# Altium project differential driver.PrjPcb
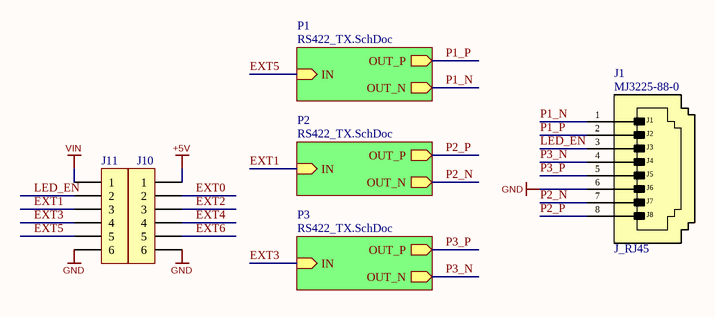
[diagram p0: differential driver.SchDoc]
2 sheets, 18 parts. Net scope: hierarchical (ports join the sheet entries above them; power ports are global).
Board file: differential driver.PcbDoc
Sheets:
  differential driver.SchDoc
    P1 = RS422_TX.SchDoc
    P2 = RS422_TX.SchDoc
    P3 = RS422_TX.SchDoc

## Sheet differential driver.SchDoc
size A; SheetNumber: 1; SheetTotal: 2

### Parts
J1  value MJ3225-88-0  [J_RJ45_MJ3225-88-0]  (hidden comment: Modular Connector, Modular Jack, 1 x 1 (Port), 8P8C, Cat3)
J10  Goldpin  [P_HEADER_1x6_2.54]  (value not drawn)
J11  Goldpin  [P_HEADER_1x6_2.54]  (value not drawn)

### Sub-sheets
P1 = RS422_TX.SchDoc: IN (in), OUT_P (out), OUT_N (out)
P2 = RS422_TX.SchDoc: IN (in), OUT_P (out), OUT_N (out)
P3 = RS422_TX.SchDoc: IN (in), OUT_P (out), OUT_N (out)

### Nets
+5V: J10.1
GND: J1.6 J10.6 J11.6
VIN: J11.1
EXT0: J10.2
EXT1: J11.3 ; sheet P2/IN
EXT2: J10.3
EXT3: J11.4 ; sheet P3/IN
EXT4: J10.4
EXT5: J11.5 ; sheet P1/IN
EXT6: J10.5
LED_EN: J1.3 J11.2
P1_N: J1.1 ; sheet P1/OUT_N
P1_P: J1.2 ; sheet P1/OUT_P
P2_N: J1.7 ; sheet P2/OUT_N
P2_P: J1.8 ; sheet P2/OUT_P
P3_N: J1.4 ; sheet P3/OUT_N
P3_P: J1.5 ; sheet P3/OUT_P

### Notes on the sheet
- (in symbol J_RJ45_MJ3225-88-0) J2; J3; J4; J5; J6; J7; J8

### Library data of the parts
J1 = J_RJ45_MJ3225-88-0: Manufacturer: Global Connector Technology; SCH_Footprint: J_RJ45; Part Number: J_RJ45_MJ3225-88-0; HelpURL: https://www.farnell.com/cad/3781788.pdf; Manufacturer Part Number: MJ3225-88-0; Supplier 1: TME; Supplier 2: RS Components; Supplier 3: Farnell; Supplier Part Number 3: 4071641; Supplier 4: Mouser; Supplier 5: Digi-Key; Supplier 6: LCSC; Supplier 7: Newark; Supplier Part Number 7: 61AK4308
J10 J11 = P_HEADER_1x6_2.54: Pin Header; Manufacturer: Connfly; SCH_Footprint: 1x6 2.54mm; Value: DS1021-1*6SF1-1; Part Number: P_HEADER_1x6_2.54; HelpURL: http://www.tme.eu/en/Document/cc301e58a5da78cb543a94b5a5b7f06a/DS1021.pdf; Manufacturer Part Number: DS1021-1*6SF1-1; Supplier 1: TME; Supplier Part Number 1: ZL201-06G; Supplier 2: RS Components; Supplier 3: Farnell; Supplier 4: Mouser; Supplier 5: Digi-Key; Supplier 6: LCSC

## Sheet RS422_TX.SchDoc
size A; SheetNumber: 2; SheetTotal: 2
Used 3 times, as channels P1, P2, P3. Parts and nets are listed once, with the designators drawn on the sheet.
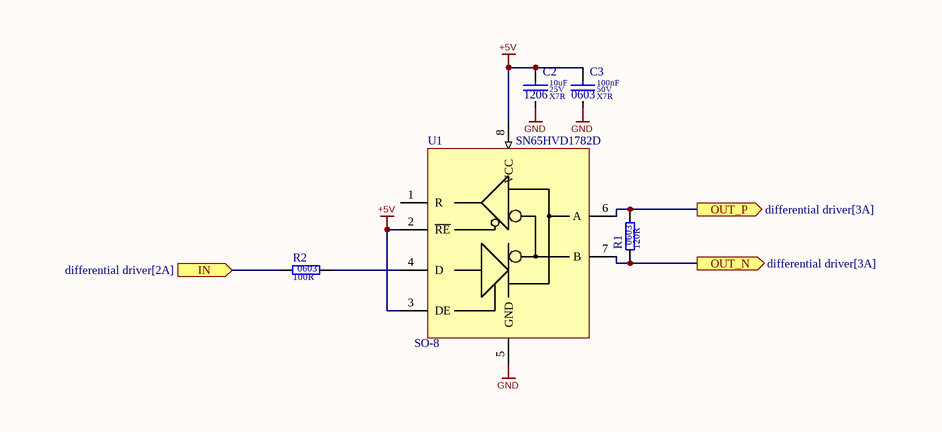
[diagram p1: RS422_TX.SchDoc]

### Parts
C2  value 10uF  Dielectric: X7R  Voltage: 25V  SCH_Footprint: 1206  [C_1206_3216]  (hidden comment: Ceramic X7R)
C3  value 100nF  Dielectric: X7R  Voltage: 50V  SCH_Footprint: 0603  [C_0603_1608]  (hidden comment: Ceramic X7R)
R1  value 120R  SCH_Footprint: 0603  [R_0603_1608]  (hidden comment: Resistor)
R2  value 100R  SCH_Footprint: 0603  [R_0603_1608]  (hidden comment: Resistor)
U1  value SN65HVD1782D  SCH_Footprint: SO-8  [SOP8_SO8_SOIC8_4X5X18]  (hidden comment: Transceiver)

### Ports
IN (in, see differential driver[2A]), OUT_N (out, see differential driver[3A]), OUT_P (out, see differential driver[3A])

### Nets
+5V: C2.1 C3.1 U1.2(~{RE}) U1.3(DE) U1.8(VCC)
GND: C2.2 C3.2 U1.5(GND)
IN: R2.1 ; port IN
OUT_N: R1.1 U1.7(B) ; port OUT_N
OUT_P: R1.2 U1.6(A) ; port OUT_P
NetR2_2: R2.2 U1.4(D)

Not connected (* = marked no-connect by the designer): U1 1(R)

### Channels
P1: ports IN=EXT5 OUT_N=P1_N OUT_P=P1_P
P2: designators C2=C4 C3=C5 R1=R3 R2=R4 U1=U2; ports IN=EXT1 OUT_N=P2_N OUT_P=P2_P
P3: designators C2=C6 C3=C7 R1=R5 R2=R6 U1=U3; ports IN=EXT3 OUT_N=P3_N OUT_P=P3_P

### Library data of the parts
C2 = C_10uF_25V_X7R_1206_10: Capacitor; Manufacturer: Samsung; Manufacturer Part Number: CL31B106KAHNNNE; Tolerance (%): 10; Part Number: C_10uF_25V_X7R_1206_10; HelpURL: http://www.tme.eu/pl/Document/4a42202b32dab16128fe107dd69598cc/samsung-chip-cap.pdf; Supplier 1: TME; Supplier Part Number 1: CL31B106KAHNNNE; Supplier 2: RS Components; Supplier Part Number 2: 766-6773; Supplier 3: Farnell; Supplier Part Number 3: 3013526; Supplier 4: Mouser; Supplier Part Number 4: 187-CL31B106KAHNNNE; Supplier 5: Digi-Key; Supplier Part Number 5: 1276-1804-1-ND; Supplier 6: LCSC
C3 = C_100nF_50V_X7R_0603_5: Capacitor; Manufacturer: Samsung; Manufacturer Part Number: CL10B104JB8NNNC; Tolerance (%): 5; Part Number: C_100nF_50V_X7R_0603_5; HelpURL: http://www.tme.eu/pl/Document/4a42202b32dab16128fe107dd69598cc/samsung-chip-cap.pdf; Supplier 1: TME; Supplier Part Number 1: CL10B104JB8NNNC; Supplier 2: RS Components; Supplier Part Number 2: 7665455; Supplier 3: Farnell; Supplier 4: Mouser; Supplier 5: Digi-Key; Supplier Part Number 5: 1276-1033-1-ND; Supplier 6: LCSC; Supplier Part Number 6: C24452
R1 = R_120R_0603_1_AECQ0: Manufacturer: Panasonic; Manufacturer Part Number: ERJ-3EKF1200V; Voltage: 75V; Power: 100mW; Tolerance: 1%; Part Number: R_120R_0603_1_AECQ0; HelpURL: https://industrial.panasonic.com/cdbs/www-data/pdf/RDA0000/AOA0000C304.pdf; Supplier 1: TME; Supplier Part Number 1: ERJ3EKF1200V; Supplier 2: RS Components; Supplier 3: Farnell; Supplier Part Number 3: 2303067; Supplier 4: Mouser; Supplier Part Number 4: 667-ERJ-3EKF1200V; Supplier 5: Digi-Key; Supplier Part Number 5: P120HCT-ND; Supplier 6: LCSC; Supplier Part Number 6: C169257
R2 = R_100R_0603_1: Manufacturer: Yageo; Manufacturer Part Number: RC0603FR-07100RL; Voltage: 50V; Power: 100mW; Tolerance: 1%; Part Number: R_100R_0603_1; HelpURL: http://www.tme.eu/en/Document/d2a72e545e5c8eb7bf2a04fa97535928/rc0603yageo.pdf; Supplier 1: TME; Supplier Part Number 1: RC0603FR-07100R; Supplier 2: RS Components; Supplier 3: Farnell; Supplier Part Number 3: 2131804; Supplier 4: Mouser; Supplier Part Number 4: 603-RC0603FR-07100RL; Supplier 5: Digi-Key; Supplier Part Number 5: 311-100HRCT-ND; Supplier 6: LCSC
U1 = U_SN65HVD1782DR: Fault-Protected  RS-485  Transceivers  With 3.3-V to 5-V Operation; Manufacturer: Texas Instruments; Part Number: U_SN65HVD1782DR; HelpURL: http://www.ti.com/lit/ds/slls877h/slls877h.pdf; Manufacturer Part Number: SN65HVD1782D; Supplier 1: TME; Supplier 2: RS Components; Supplier Part Number 2: 7093179P; Supplier 3: Farnell; Supplier Part Number 3: 1755056; Supplier 4: Mouser; Supplier Part Number 4: 595-SN65HVD1782D; Supplier 5: Digi-Key; Supplier Part Number 5: 296-33574-5-ND; Supplier 6: LCSC

## Nets that join several sheets
+5V: differential driver (J10.1), P1 (5 pins), P2 (5 pins), P3 (5 pins)
GND: differential driver (J1.6 J10.6 J11.6), P1 (C2.2 C3.2 U1.5), P2 (C4.2 C5.2 U2.5), P3 (C6.2 C7.2 U3.5)
EXT1: differential driver (J11.3), P2 (R4.1)
EXT3: differential driver (J11.4), P3 (R6.1)
EXT5: differential driver (J11.5), P1 (R2.1)
P1_N: differential driver (J1.1), P1 (R1.1 U1.7)
P1_P: differential driver (J1.2), P1 (R1.2 U1.6)
P2_N: differential driver (J1.7), P2 (R3.1 U2.7)
P2_P: differential driver (J1.8), P2 (R3.2 U2.6)
P3_N: differential driver (J1.4), P3 (R5.1 U3.7)
P3_P: differential driver (J1.5), P3 (R5.2 U3.6)